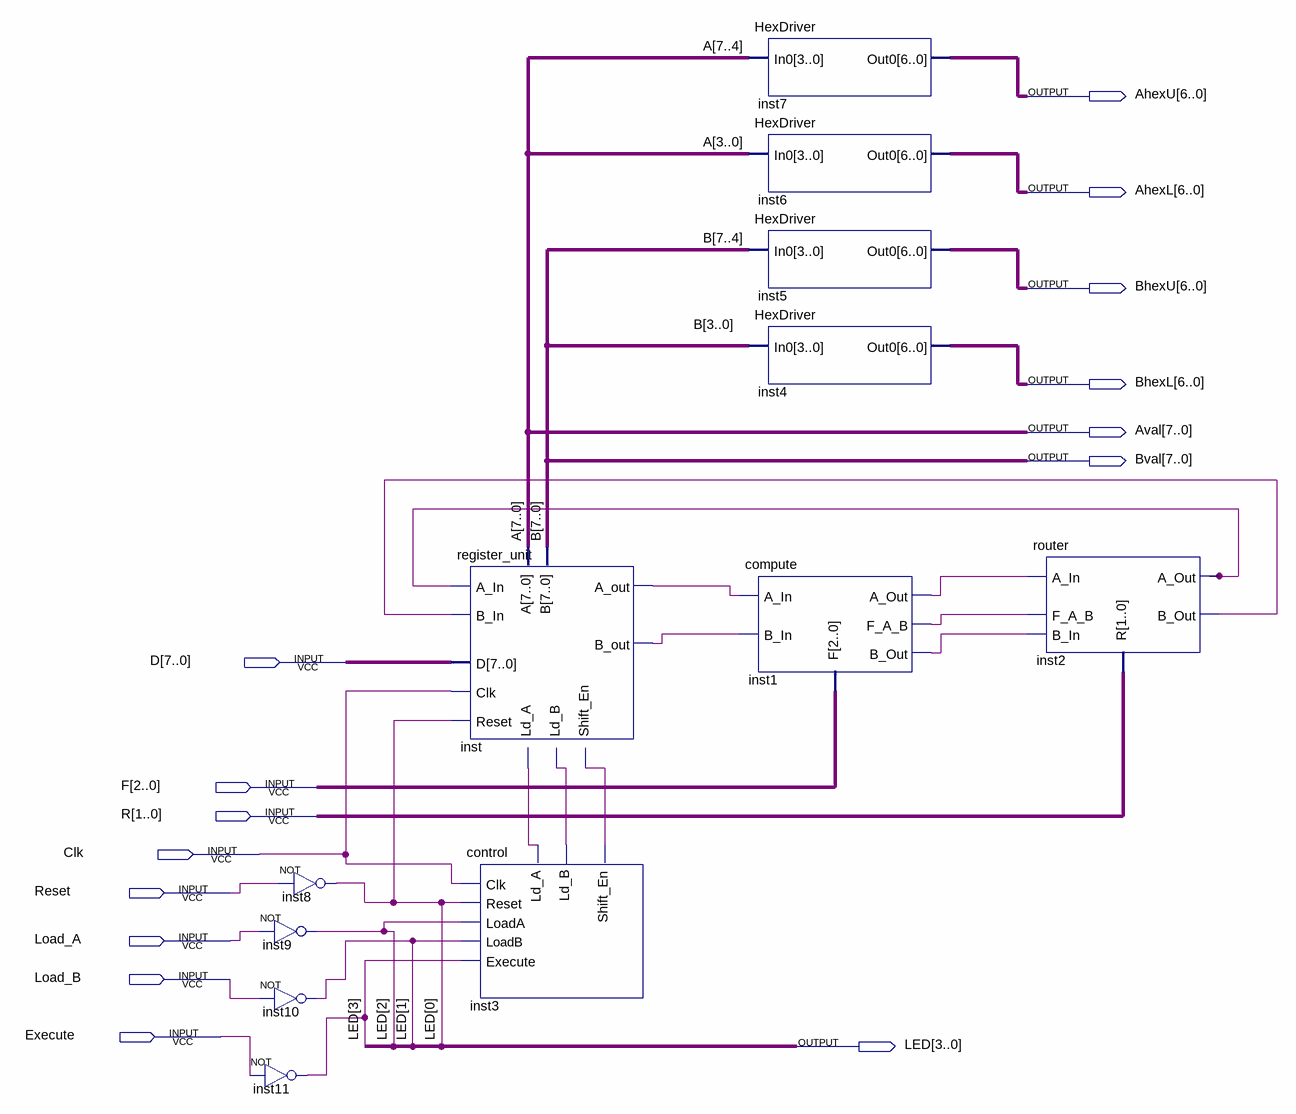
[diagram p0: schematic sheet]
// Quartus schematic Processor.bdf as structural Verilog: 12 symbols, 15 pins
module Processor (
  input  [7:0] D,
  input  [2:0] F,
  input  [1:0] R,
  input  Clk,
  input  Reset,
  input  Load_A,
  input  Load_B,
  input  Execute,
  output [6:0] AhexU,
  output [6:0] AhexL,
  output [6:0] BhexU,
  output [6:0] BhexL,
  output [7:0] Aval,
  output [7:0] Bval,
  output [3:0] LED
);

  wire inst1_a_out, inst1_b_out, inst1_f_a_b, inst2_a_out, inst2_b_out, inst3_ld_a, inst3_ld_b,
       inst3_shift_en, inst_a_out, inst_b_out;

  not inst8 (LED[0], Reset);
  not inst9 (LED[2], Load_A);
  not inst10 (LED[1], Load_B);
  not inst11 (LED[3], Execute);
  register_unit inst (
    .Clk(Clk), .Reset(LED[0]), .A_In(inst2_a_out), .B_In(inst2_b_out), .Ld_A(inst3_ld_a), .Ld_B(inst3_ld_b),
    .Shift_En(inst3_shift_en), .D(D), .A_out(inst_a_out), .B_out(inst_b_out), .A(Aval), .B(Bval));
  control inst3 (
    .Clk(Clk), .Reset(LED[0]), .LoadA(LED[2]), .LoadB(LED[1]), .Execute(LED[3]), .Shift_En(inst3_shift_en),
    .Ld_A(inst3_ld_a), .Ld_B(inst3_ld_b));
  HexDriver inst7 (.In0(Aval[7:4]), .Out0(AhexU));
  HexDriver inst6 (.In0(Aval[3:0]), .Out0(AhexL));
  HexDriver inst5 (.In0(Bval[7:4]), .Out0(BhexU));
  HexDriver inst4 (.In0(Bval[3:0]), .Out0(BhexL));
  compute inst1 (
    .F(F), .A_In(inst_a_out), .B_In(inst_b_out), .A_Out(inst1_a_out), .B_Out(inst1_b_out), .F_A_B(inst1_f_a_b));
  router inst2 (
    .R(R), .A_In(inst1_a_out), .B_In(inst1_b_out), .F_A_B(inst1_f_a_b), .A_Out(inst2_a_out),
    .B_Out(inst2_b_out));

  // Other names for the same wires on the sheet: A[7:0] = Aval; B[7:0] = Bval
endmodule
